# EAGLE design Regulator_V1_0 (EAGLE 4.16)
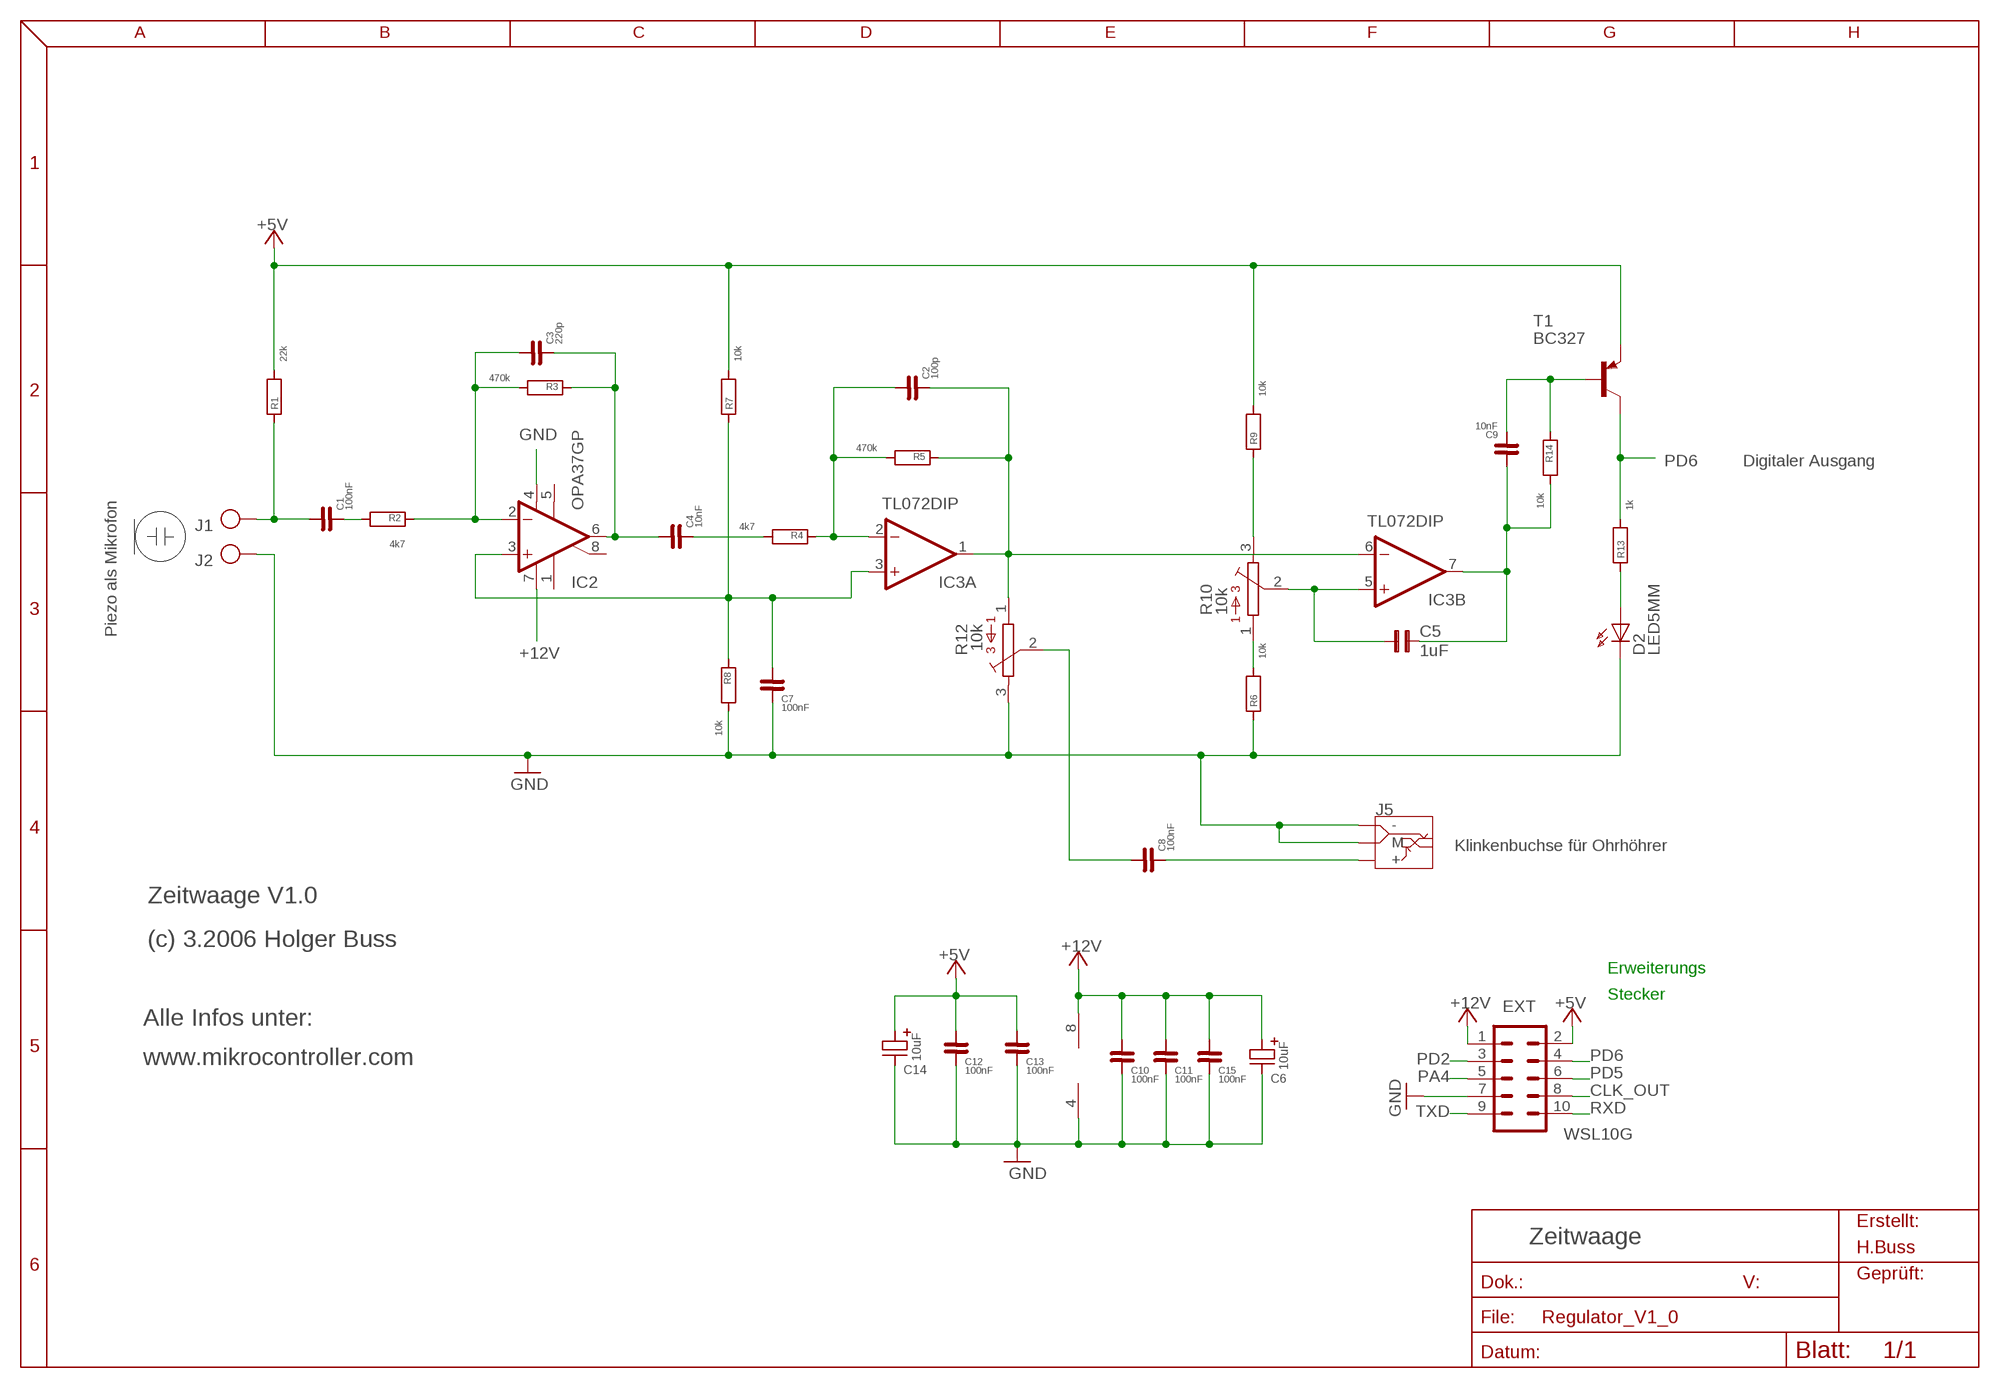
[diagram p0: schematic, sheet 1]

## Parts
C1  100nF  C-5,0  [C-5,0]
C2  100p  C-2,5-MINI  [C-2,5]
C3  220p  C-2,5-MINI  [C-2,5]
C4  10nF  C-5,0  [C-5,0]
C5  1uF  C5/5  [C5B5]
C6  10uF  C-ELKO2,5BEDRAHT  [C-2,5-EL]
C7  100nF  C-5,0  [C-5,0]
C8  100nF  C-5,0  [C-5,0]
C9  10nF  C-5,0  [C-5,0]
C10  100nF  C-5,0  [C-5,0]
C11  100nF  C-5,0  [C-5,0]
C12  100nF  C-5,0  [C-5,0]
C13  100nF  C-5,0  [C-5,0]
C14  10uF  C-ELKO2,5BEDRAHT  [C-2,5-EL]
C15  100nF  C-5,0  [C-5,0]
D2  LED5MM  [LED5MM]
EXT  WSL10G  ML10  [ML10]
IC2  OPA37GP  OP27Z  [DIL08]
IC3  TL072DIP  LF353N  [DIL08]
J1  PIN_08  [PAD_08]
J2  PIN_08  [PAD_08]
J5  EBS35  [EBS35]
R1  22k  R-10  [R-10]
R2  4k7  R-10  [R-10]
R3  470k  R-10  [R-10]
R4  4k7  R-10  [R-10]
R5  470k  R-10  [R-10]
R6  10k  R-10  [R-10]
R7  10k  R-10  [R-10]
R8  10k  R-10  [R-10]
R9  10k  R-10  [R-10]
R10  10k  LI10  [LI10]
R12  10k  LI10  [LI10]
R13  1k  R-10  [R-10]
R14  10k  R-10  [R-10]
T1  BC327  [TO92]

## Nets
+5V: C12.P$2 C13.P$2 C14.PLUS EXT.2 R1.P$2 R7.P$2 R9.P$2 T1.1(E)
+12V: C6.PLUS C10.P$2 C11.P$2 C15.P$2 EXT.1 IC2.7(V+) IC3.8(P:V+)
CLK_OUT: EXT.8
DIG_OUT: C5.2 C9.P$2 IC3.7(B:OUT) R14.P$2
GND: C6.MINUS C7.P$1 C10.P$1 C11.P$1 C12.P$1 C13.P$1 C14.MINUS C15.P$1 D2.K(C) EXT.7 IC2.4(V-) IC3.4(P:V-) J2.P$1(P) J5.P$2(M) J5.P$3(-) R6.P$1 R8.P$2 R12.3
N$1: C1.P$2 J1.P$1(P) R1.P$1
N$2: C4.P$1 R4.P$2
N$3: C8.P$2 R12.2
N$4: D2.A R13.P$1
N$5: C1.P$1 R2.P$2
N$6: C3.P$2 IC2.2(-IN) R2.P$1 R3.P$2
N$7: C2.P$2 IC3.2(A:-IN) R4.P$1 R5.P$2
N$8: C3.P$1 C4.P$2 IC2.6(OUT) R3.P$1
N$10: C2.P$1 IC3.1(A:OUT) IC3.6(B:-IN) R5.P$1 R12.1
N$11: C7.P$2 IC2.3(+IN) IC3.3(A:+IN) R7.P$1 R8.P$1
N$12: R6.P$2 R10.1
N$14: R9.P$1 R10.3
N$15: C5.1 IC3.5(B:+IN) R10.2
N$16: C9.P$1 R14.P$1 T1.2(B)
N$20: C8.P$1 J5.P$1(+)
PA4: EXT.5
PD2: EXT.3
PD5: EXT.6
PD6: EXT.4 R13.P$2 T1.3(C)
RXD: EXT.10
TXD: EXT.9
Unconnected: IC2.1(ON1) IC2.5(OPT) IC2.8(ON2)

## Notes on the sheet
- Digitaler Ausgang
- Piezo als Mikrofon
- Klinkenbuchse für Ohrhöhrer
- Zeitwaage V1.0
- (c) 3.2006 Holger Buss
- Erweiterungs
- Stecker
- Alle Infos unter:
- www.mikrocontroller.com
- Zeitwaage

## Library data of the parts
C1 C4 C7-C13 C15 = 0MY_STD_LIB:C-5,0
C2 C3 = 0MY_STD_LIB:C-2,5-MINI
C5 = capacitor-wima:C: CAPACITOR naming: grid - package width
C6 C14 = 0MY_STD_LIB:C-ELKO
D2 = led:LED5MM: LED 5 mm, round
EXT = CON-ML:ML10
IC2 = linear:OP27: OP AMP
IC3 = linear:LF353: OP AMP
J1 J2 = 0MY_STD_LIB:PIN_08
J5 = 0MY_STD_LIB:EBS35
R1-R9 R13 R14 = 0MY_STD_LIB:R-10
R10 R12 = pot:LI10: POTENTIOMETER
T1 = transistor-pnp:BC327: PNP TRANSISTOR

## Board
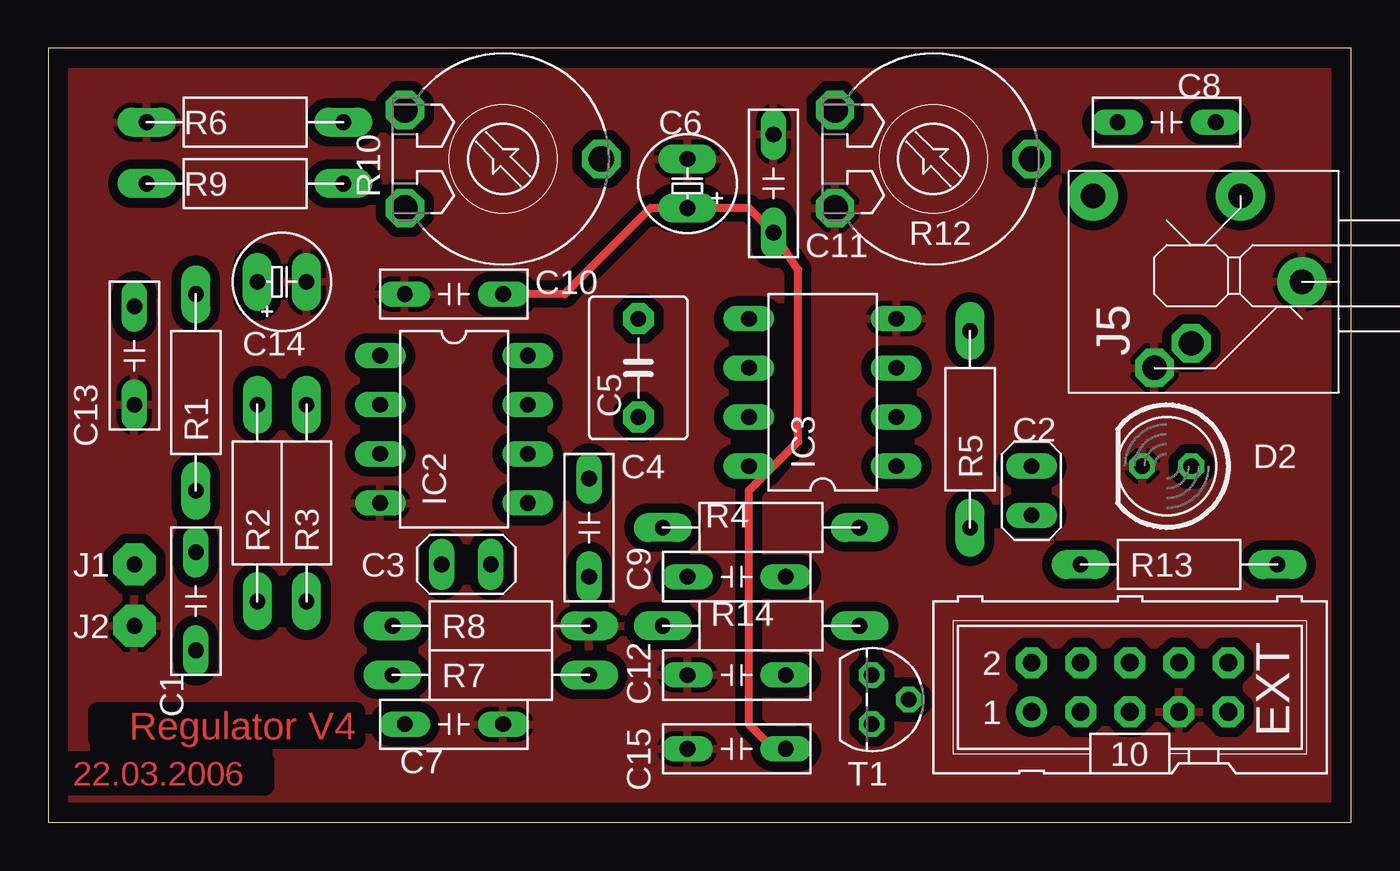
[diagram p1: board, top side]
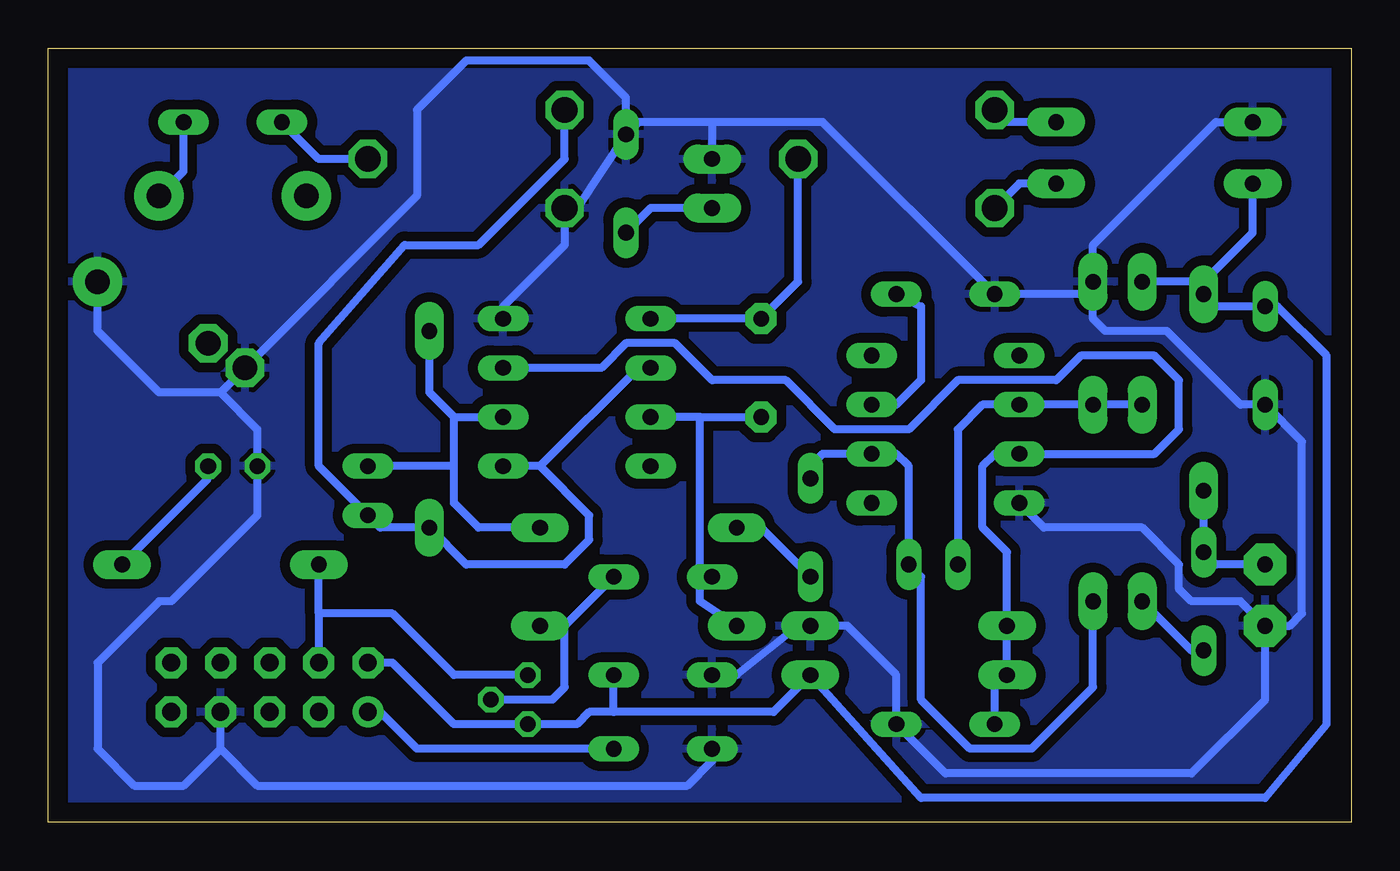
[diagram p2: board, bottom side, seen from below]

Size 67.31 x 40.01 mm. Coordinates in mm from the lower left corner, seen from the top.
Outline: 0,40.01 0,0 67.31,0 67.31,40.01 0,40.01
Copper layers (1*16): Top 0.035mm / dielectric 1.5mm / Bottom 0.035mm
Design rules "default": minimum track width 10mil, minimum drill 24mil, track to track 8mil, track to pad 8mil, pad to pad 8mil, via to via 8mil, smd to smd 8mil, copper to edge 40mil, drill to drill 8mil, minimum pad ring 10mil, minimum via ring 8mil, stop-mask expansion 0mil, vias tented up to drill 0mil, thermal gap 10mil

### Footprints (pad centres in the part's own frame; a part is rotated, then mirrored left to right if it is on the bottom)
C-5,0 = drill 0.813 pad 1.27 long: P$1 0,0; P$2 5.08,0
C-2,5 = drill 0.813 pad 1.27 long: P$1 0,0; P$2 2.54,0
C5B5 = drill 0.813 pad 1.6 octagon: 1 -2.54,0; 2 2.54,0
C-2,5-EL = drill 0.813 pad 1.5 long: MINUS 2.54,0; PLUS 0,0
LED5MM = drill 0.813 octagon: A -1.27,0; K 1.27,0
ML10 = drill 0.914 pad 1.6 round: 1 -5.08,-1.27 | drill 0.914 pad 1.6 octagon: 2 -5.08,1.27; 3 -2.54,-1.27; 4 -2.54,1.27; 5 0,-1.27; 6 0,1.27; 7 2.54,-1.27; 8 2.54,1.27; 9 5.08,-1.27; 10 5.08,1.27
DIL08 = drill 0.813 long: 1 -3.81,-3.81; 2 -1.27,-3.81; 3 1.27,-3.81; 4 3.81,-3.81; 5 3.81,3.81; 6 1.27,3.81; 7 -1.27,3.81; 8 -3.81,3.81
PAD_08 = drill 0.813 pad 2.184 octagon: P$1 0,0
EBS35 = drill 1.27 pad 2.54 round: P$1 0,0; P$2 -4.445,-3.175; P$4 0,7.62 | drill 1.27 pad 2 octagon: P$3 -8.89,4.445; P$5 -7.62,2.54
R-10 = drill 0.813 pad 1.5 long: P$1 0,0; P$2 10.16,0
LI10 = drill 1.321 octagon: 1 -2.54,-5.08; 2 0,5.08; 3 2.54,-5.08
TO92 = drill 0.813 octagon: 1 1.27,0; 2 0,1.905; 3 -1.27,0

### Placement (x,y rotation side)
C1  7.62,8.89 90 top
C2  50.8,15.88 90 top
C3  22.86,13.34 180 top
C4  27.94,12.7 90 top
C5  30.48,23.5 270 top
C6  33.02,31.75 90 top
C7  23.5,5.08 180 top
C8  60.33,36.2 180 top
C9  38.1,12.7 180 top
C10  18.41,27.3 0 top
C11  37.47,35.56 270 top
C12  33.02,7.62 0 top
C13  4.45,21.59 90 top
C14  10.79,27.94 0 top
C15  33.02,3.81 0 top
D2  57.78,18.41 180 top
EXT  55.88,6.99 0 top
IC2  20.95,20.32 270 top
IC3  40.01,22.23 90 top
J1  4.45,13.34 0 top
J2  4.45,10.16 0 top
J5  61.59,32.38 90 top
R1  7.62,17.14 90 top
R2  10.79,21.59 270 top
R3  13.34,11.43 90 top
R4  41.91,15.24 180 top
R5  47.62,15.24 90 top
R6  5.08,36.2 0 top
R7  17.78,7.62 0 top
R8  17.78,10.16 0 top
R9  15.24,33.02 180 top
R10  23.5,34.29 270 top
R12  45.72,34.29 270 top
R13  63.5,13.34 180 top
R14  41.91,10.16 180 top
T1  42.55,6.35 270 top

### Tracks (layer width: path | path; a pad name or v marks a point on that pad's centre or on a via)
+5V
  Bottom 0.406: 7.62,27.94 C14.PLUS | 7.62,27.94 R1.P$2 6.99,26.67 C13.P$2 3.81,26.67 1.27,24.13 1.27,5.08 4.45,1.27 22.23,1.27 R7.P$2 29.84,5.71 38.1,5.71 | EXT.2 49.53,8.26 46.35,5.08 T1.1 40.01,5.08 39.37,5.71 38.1,5.71 | 38.1,5.71 C12.P$2 | R9.P$2 5.08,30.48 7.62,27.94
+12V
  Top 0.406: 37.47,18.41 IC3.8 | 37.47,18.41 38.73,19.68 38.73,28.57 C11.P$2 36.2,31.75 C6.PLUS 31.11,31.75 26.67,27.3 C10.P$2 | C15.P$2 37.47,3.81 36.2,5.08 36.2,17.14 37.47,18.41
  Bottom 0.406: C10.P$2 22.23,26.67 22.23,22.86 23.5,21.59 IC2.7 | EXT.1 50.16,5.71 48.26,3.81 C15.P$2 | C6.PLUS 36.2,31.75 C11.P$2
DIG_OUT
  Bottom 0.406: 33.66,12.7 33.66,11.43 R14.P$2 | 33.66,12.7 33.66,20.95 | 33.66,20.95 IC3.7 | 33.66,20.95 C5.2 | 33.66,12.7 C9.P$2
GND
  Bottom 0.406: C12.P$1 31.75,7.62 28.57,10.16 R8.P$2 26.04,10.16 23.5,7.62 C7.P$1 20.95,2.54 8.26,2.54 4.45,6.35 J2.P$1 | 58.42,22.23 J5.P$3 48.26,32.38 48.26,36.83 45.72,39.37 39.37,39.37 37.47,37.47 C11.P$1 | 58.42,22.23 61.59,22.23 64.77,25.4 J5.P$2 | C14.MINUS 13.34,26.04 12.7,25.4 9.53,25.4 5.71,21.59 C13.P$1 2.54,19.68 2.54,10.79 3.17,10.16 J2.P$1 | C14.MINUS 13.97,27.3 C10.P$1 27.3,36.2 33.02,36.2 | C11.P$1 40.01,31.75 R12.3 40.64,29.84 43.81,26.67 IC3.4 | 58.42,22.23 56.52,20.32 D2.K 56.52,15.88 60.96,11.43 61.59,11.43 64.77,8.26 64.77,3.81 62.87,1.91 60.33,1.91 58.42,3.81 | 58.42,3.81 EXT.7 | C11.P$1 36.83,36.2 33.02,36.2 | 33.02,36.2 C6.MINUS | R6.P$1 6.99,36.2 13.34,29.84 C14.MINUS | IC2.4 15.88,15.24 10.79,15.24 8.89,13.34 8.89,12.06 8.26,11.43 5.71,11.43 J2.P$1 | C15.P$1 33.02,3.17 34.29,1.91 56.52,1.91 58.42,3.81
  pour Top (isolate 0.5): 0,40.01 0,0 67.31,0 67.31,40.01
  pour Bottom (isolate 0.5): 0,40.01 0,0 67.31,0 67.31,40.01
N$1
  Bottom 0.406: J1.P$1 6.99,13.34 C1.P$2 R1.P$1
N$2
  Bottom 0.406: C4.P$1 30.48,15.24 R4.P$2
N$3
  Bottom 0.406: R12.2 53.34,34.29 C8.P$2
N$4
  Bottom 0.406: D2.A 59.05,17.78 R13.P$1
N$5
  Bottom 0.406: C1.P$1 8.26,8.89 R2.P$2
N$6
  Bottom 0.406: R2.P$1 R3.P$2 IC2.2 19.05,21.59 20.32,20.32 C3.P$2
N$7
  Bottom 0.406: R5.P$2 47.62,22.23 46.35,20.95 | 43.18,20.95 IC3.2 46.35,20.95 | R4.P$1 45.09,15.24 46.35,16.51 46.35,18.41 | 46.35,18.41 46.35,20.95 | 46.35,18.41 C2.P$2
N$8
  Bottom 0.406: R3.P$1 13.34,6.99 16.51,3.81 19.68,3.81 22.23,6.35 22.23,12.7 C3.P$1 22.86,18.41 23.5,19.05 IC2.6 27.3,19.05 27.94,18.41 C4.P$2
N$10
  Bottom 0.406: IC3.6 36.83,23.5 41.91,18.41 | 41.91,18.41 IC3.1 | R12.1 40.64,34.29 45.09,29.84 48.9,29.84 53.34,24.77 53.34,18.41 C2.P$1 50.16,15.24 R5.P$1 45.72,13.34 40.64,13.34 39.37,14.61 39.37,15.88 41.91,18.41
N$11
  Bottom 0.406: C7.P$2 18.41,6.99 R7.P$1 R8.P$1 17.78,13.97 19.05,15.24 19.05,18.41 18.41,19.05 IC2.3 10.16,19.05 8.89,20.32 8.89,22.86 10.16,24.13 13.97,24.13 15.24,22.86 20.32,22.86 22.86,20.32 26.67,20.32 29.21,22.86 33.02,22.86 34.92,24.77 37.47,24.77 38.73,23.5 IC3.3
N$12
  Bottom 0.406: R6.P$2 17.78,36.2 R10.1
N$14
  Bottom 0.406: R9.P$1 17.14,33.02 R10.3
N$15
  Bottom 0.406: IC3.5 C5.1 28.57,27.94 R10.2
N$16
  Bottom 0.406: 40.64,10.16 40.64,6.99 41.27,6.35 T1.2 | 40.64,10.16 C9.P$1 | 40.64,10.16 R14.P$1
N$20
  Bottom 0.406: C8.P$1 60.33,33.66 J5.P$1
PD6
  Bottom 0.406: 53.34,10.79 EXT.4 | 53.34,10.79 49.53,10.79 46.35,7.62 T1.3 | 53.34,10.79 R13.P$2

### Text on the board
Top: Regulator V4 | 22.03.2006